# EAGLE schematic Schema de cablage PAMI Ninja (EAGLE 9.7.0)
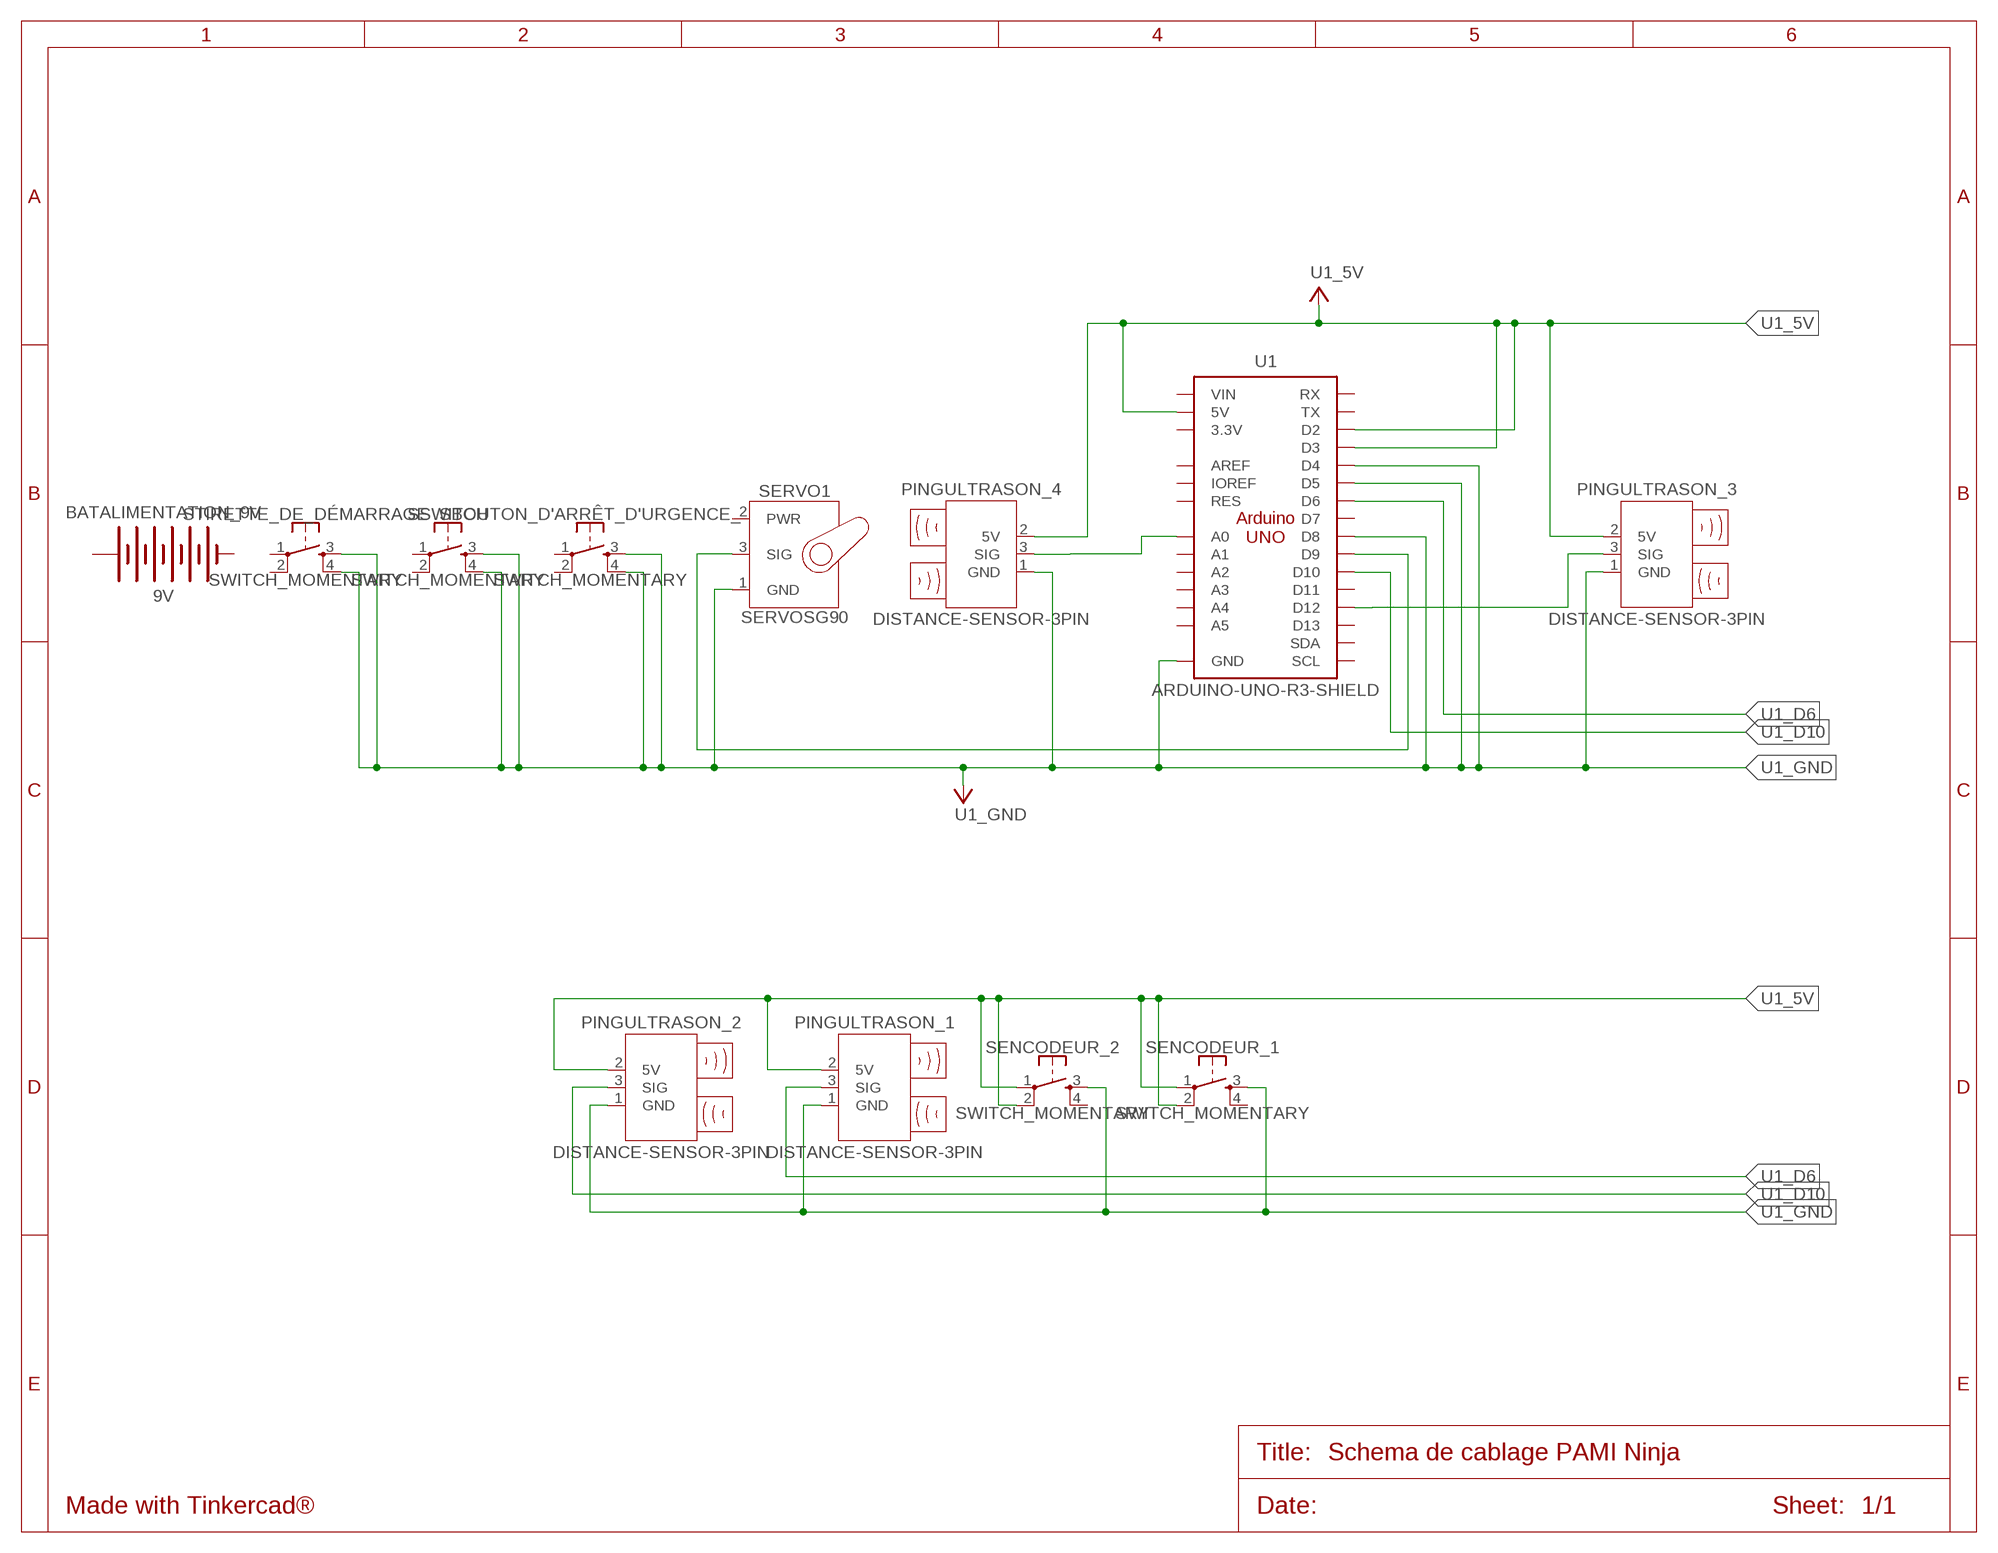
[diagram p0: schematic, sheet 1]

## Parts
BATALIMENTATION_9V  9V  BATTERY-9VGENERIC  [BATTERY-GENERIC]
PINGULTRASON_1  DISTANCE-SENSOR-3PIN  [28015]
PINGULTRASON_2  DISTANCE-SENSOR-3PIN  [28015]
PINGULTRASON_3  DISTANCE-SENSOR-3PIN  [28015]
PINGULTRASON_4  DISTANCE-SENSOR-3PIN  [28015]
SBOUTON_D'ARRÊT_D'URGENCE_  SWITCH_MOMENTARY  [SWITCH-MOMENTARY-PTH-6.5MM]
SENCODEUR_1  SWITCH_MOMENTARY  [SWITCH-MOMENTARY-PTH-6.5MM]
SENCODEUR_2  SWITCH_MOMENTARY  [SWITCH-MOMENTARY-PTH-6.5MM]
SERVO1  SERVOSG90  [SG90]
SSWITCH  SWITCH_MOMENTARY  [SWITCH-MOMENTARY-PTH-6.5MM]
STIRETTE_DE_DÉMARRAGE  SWITCH_MOMENTARY  [SWITCH-MOMENTARY-PTH-6.5MM]
U1  ARDUINO-UNO-R3-SHIELD  [ARDUINO-UNO-R3-SHIELD]

## Nets
U1_5V: PINGULTRASON_1.2(5V) PINGULTRASON_2.2(5V) PINGULTRASON_3.2(5V) PINGULTRASON_4.2(5V) SENCODEUR_1.1 SENCODEUR_1.2 SENCODEUR_2.1 SENCODEUR_2.2 U1.5V U1.D2 U1.D3
U1_A0: PINGULTRASON_4.3(SIG) U1.A0
U1_D6: PINGULTRASON_1.3(SIG) U1.D6
U1_D9: SERVO1.3(SIG) U1.D9
U1_D10: PINGULTRASON_2.3(SIG) U1.D10
U1_D12: PINGULTRASON_3.3(SIG) U1.D12
U1_GND: PINGULTRASON_1.1(GND) PINGULTRASON_2.1(GND) PINGULTRASON_3.1(GND) PINGULTRASON_4.1(GND) SBOUTON_D'ARRÊT_D'URGENCE_.3 SBOUTON_D'ARRÊT_D'URGENCE_.4 SENCODEUR_1.3 SENCODEUR_2.3 SERVO1.1(GND) SSWITCH.3 SSWITCH.4 STIRETTE_DE_DÉMARRAGE.3 STIRETTE_DE_DÉMARRAGE.4 U1.D4 U1.D5 U1.D8 U1.GND@0(GND) U1.GND@1(GND) U1.GND@2(GND)
Unconnected: BATALIMENTATION_9V.+ BATALIMENTATION_9V.- SBOUTON_D'ARRÊT_D'URGENCE_.1 SBOUTON_D'ARRÊT_D'URGENCE_.2 SENCODEUR_1.4 SENCODEUR_2.4 SERVO1.2(PWR) SSWITCH.1 SSWITCH.2 STIRETTE_DE_DÉMARRAGE.1 STIRETTE_DE_DÉMARRAGE.2 U1.3.3V U1.A1 U1.A2 U1.A3 U1.A4 U1.A5 U1.AREF U1.D7 U1.D11 U1.D13 U1.IOREF U1.RES U1.RX U1.SCL U1.SDA U1.TX U1.VIN

## Library data of the parts
BATALIMENTATION_9V = Tinkercad:BATTERY-9V
PINGULTRASON_1-PINGULTRASON_4 = Tinkercad:DISTANCE-SENSOR-3PIN
SBOUTON_D'ARRÊT_D'URGENCE_ SENCODEUR_1 SENCODEUR_2 SSWITCH STIRETTE_DE_DÉMARRAGE = Tinkercad:SWITCH_MOMENTARY
SERVO1 = Tinkercad:SERVO
U1 = Tinkercad:ARDUINO-UNO-R3-SHIELD